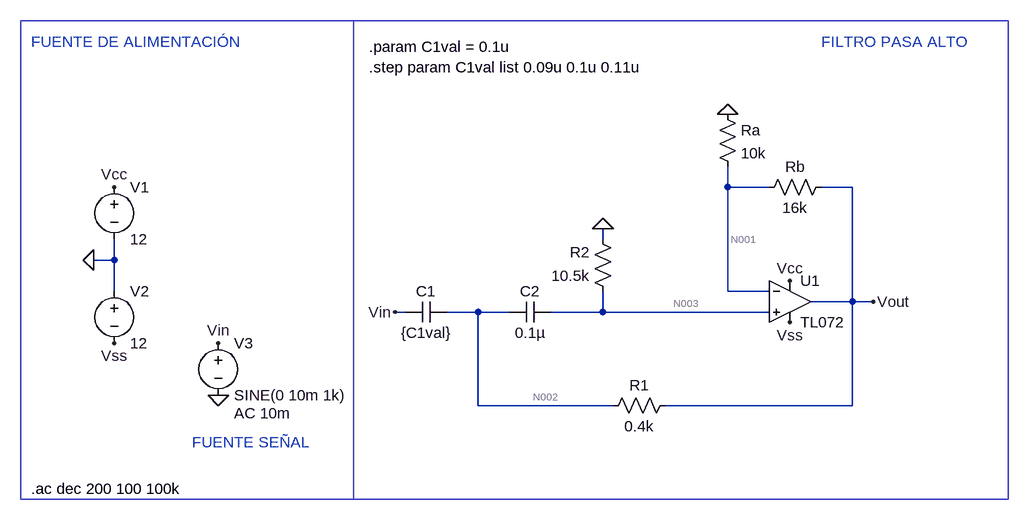
[diagram p0: schematic filtro_pa.asc]
* filtro_pa.asc
* U1: TL072 (symbol ZZZ\OpAmp\TL072 not available, pins judged from their places): In+=N003 In-=N001 V+=Vcc V-=Vss OUT=Vout
Rb Vout N001 16k
Ra 0 N001 10k
V1 Vcc 0 12
V2 0 Vss 12
V3 Vin 0 SINE(0 10m 1k) AC 10m
C1 N002 Vin {C1val}
C2 N003 N002 0.1µ
R1 Vout N002 0.4k
R2 N003 0 10.5k
* FUENTE DE ALIMENTACIÓN
* FUENTE SEÑAL
* FILTRO PASA ALTO
.ac dec 200 100 100k
.param C1val = 0.1u
.step param C1val list 0.09u 0.1u 0.11u
.backanno
.end

* Results of the author's LTspice run, read from the files saved beside the schematic
* Operating Point (first step), zero values left out:
*   c1val = 90 n
*   V(vout) = 28.05 µV
*   V(vss) = -12 V
*   V(vcc) = 12 V
*   V(n001) = 10.53 µV
*   V(n003) = -441.6 nV
*   V(n002) = 28.05 µV
*   I(R2) = -42.05 pA
*   I(Ra) = -1.053 nA
*   I(Rb) = 1.095 nA
*   I(V2) = -11.39 mA
*   I(V1) = -11.39 mA
*   Ix(u1:1) = 42.05 pA
*   Ix(u1:2) = 42.05 pA
*   Ix(u1:3) = 11.39 mA
*   Ix(u1:4) = -11.39 mA
*   Ix(u1:5) = -1.095 nA
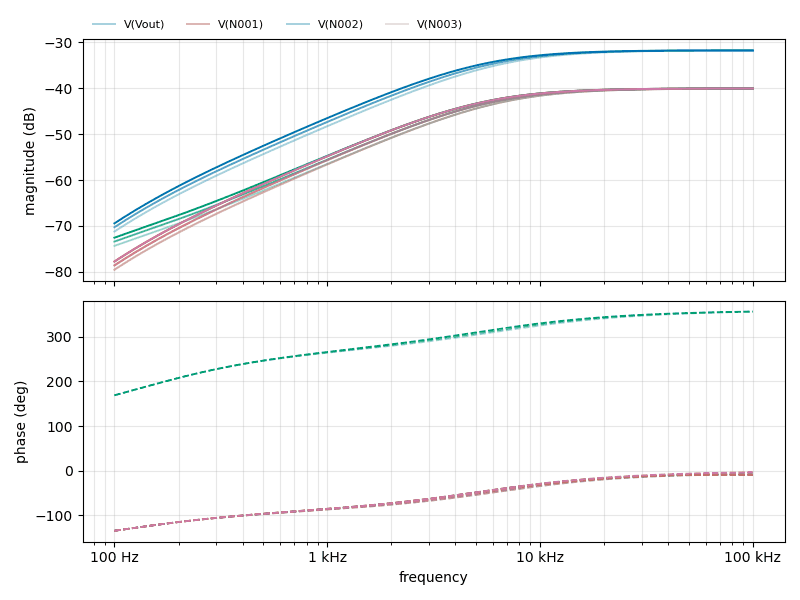
[diagram p1: AC Analysis of filtro_pa.asc, plotted from the saved traces]
* AC Analysis, 3 runs:
*   V(Vout) [c1val=9e-008]: -71.20 dB at 100 Hz, -31.84 dB at 100 kHz, peak -31.84 dB at 87.1 kHz, 3 dB below the peak at 6.508 kHz
*   V(Vout) [c1val=1e-007]: -70.27 dB at 100 Hz, -31.83 dB at 100 kHz, peak -31.83 dB at 82.22 kHz, 3 dB below the peak at 5.846 kHz
*   V(Vout) [c1val=1.1e-007]: -69.42 dB at 100 Hz, -31.82 dB at 100 kHz, peak -31.82 dB at 77.62 kHz, 3 dB below the peak at 5.301 kHz
*   V(N001) [c1val=9e-008]: -79.50 dB at 100 Hz, -40.14 dB at 100 kHz, peak -40.14 dB at 87.1 kHz, 3 dB below the peak at 6.508 kHz
*   V(N001) [c1val=1e-007]: -78.57 dB at 100 Hz, -40.13 dB at 100 kHz, peak -40.13 dB at 82.22 kHz, 3 dB below the peak at 5.846 kHz
*   V(N001) [c1val=1.1e-007]: -77.72 dB at 100 Hz, -40.12 dB at 100 kHz, peak -40.12 dB at 77.62 kHz, 3 dB below the peak at 5.301 kHz
*   V(N002) [c1val=9e-008]: -74.32 dB at 100 Hz, -40.11 dB at 100 kHz, peak -40.11 dB at 100 kHz, 3 dB below the peak at 6.552 kHz
*   V(N002) [c1val=1e-007]: -73.39 dB at 100 Hz, -40.10 dB at 100 kHz, peak -40.10 dB at 100 kHz, 3 dB below the peak at 5.882 kHz
*   V(N002) [c1val=1.1e-007]: -72.54 dB at 100 Hz, -40.09 dB at 100 kHz, peak -40.09 dB at 100 kHz, 3 dB below the peak at 5.332 kHz
*   V(N003) [c1val=9e-008]: -79.50 dB at 100 Hz, -40.11 dB at 100 kHz, peak -40.11 dB at 100 kHz, 3 dB below the peak at 6.556 kHz
*   V(N003) [c1val=1e-007]: -78.57 dB at 100 Hz, -40.10 dB at 100 kHz, peak -40.10 dB at 100 kHz, 3 dB below the peak at 5.886 kHz
*   V(N003) [c1val=1.1e-007]: -77.72 dB at 100 Hz, -40.09 dB at 100 kHz, peak -40.09 dB at 100 kHz, 3 dB below the peak at 5.336 kHz